# EAGLE design MQTT Wifi GW (EAGLE 7.4.0)
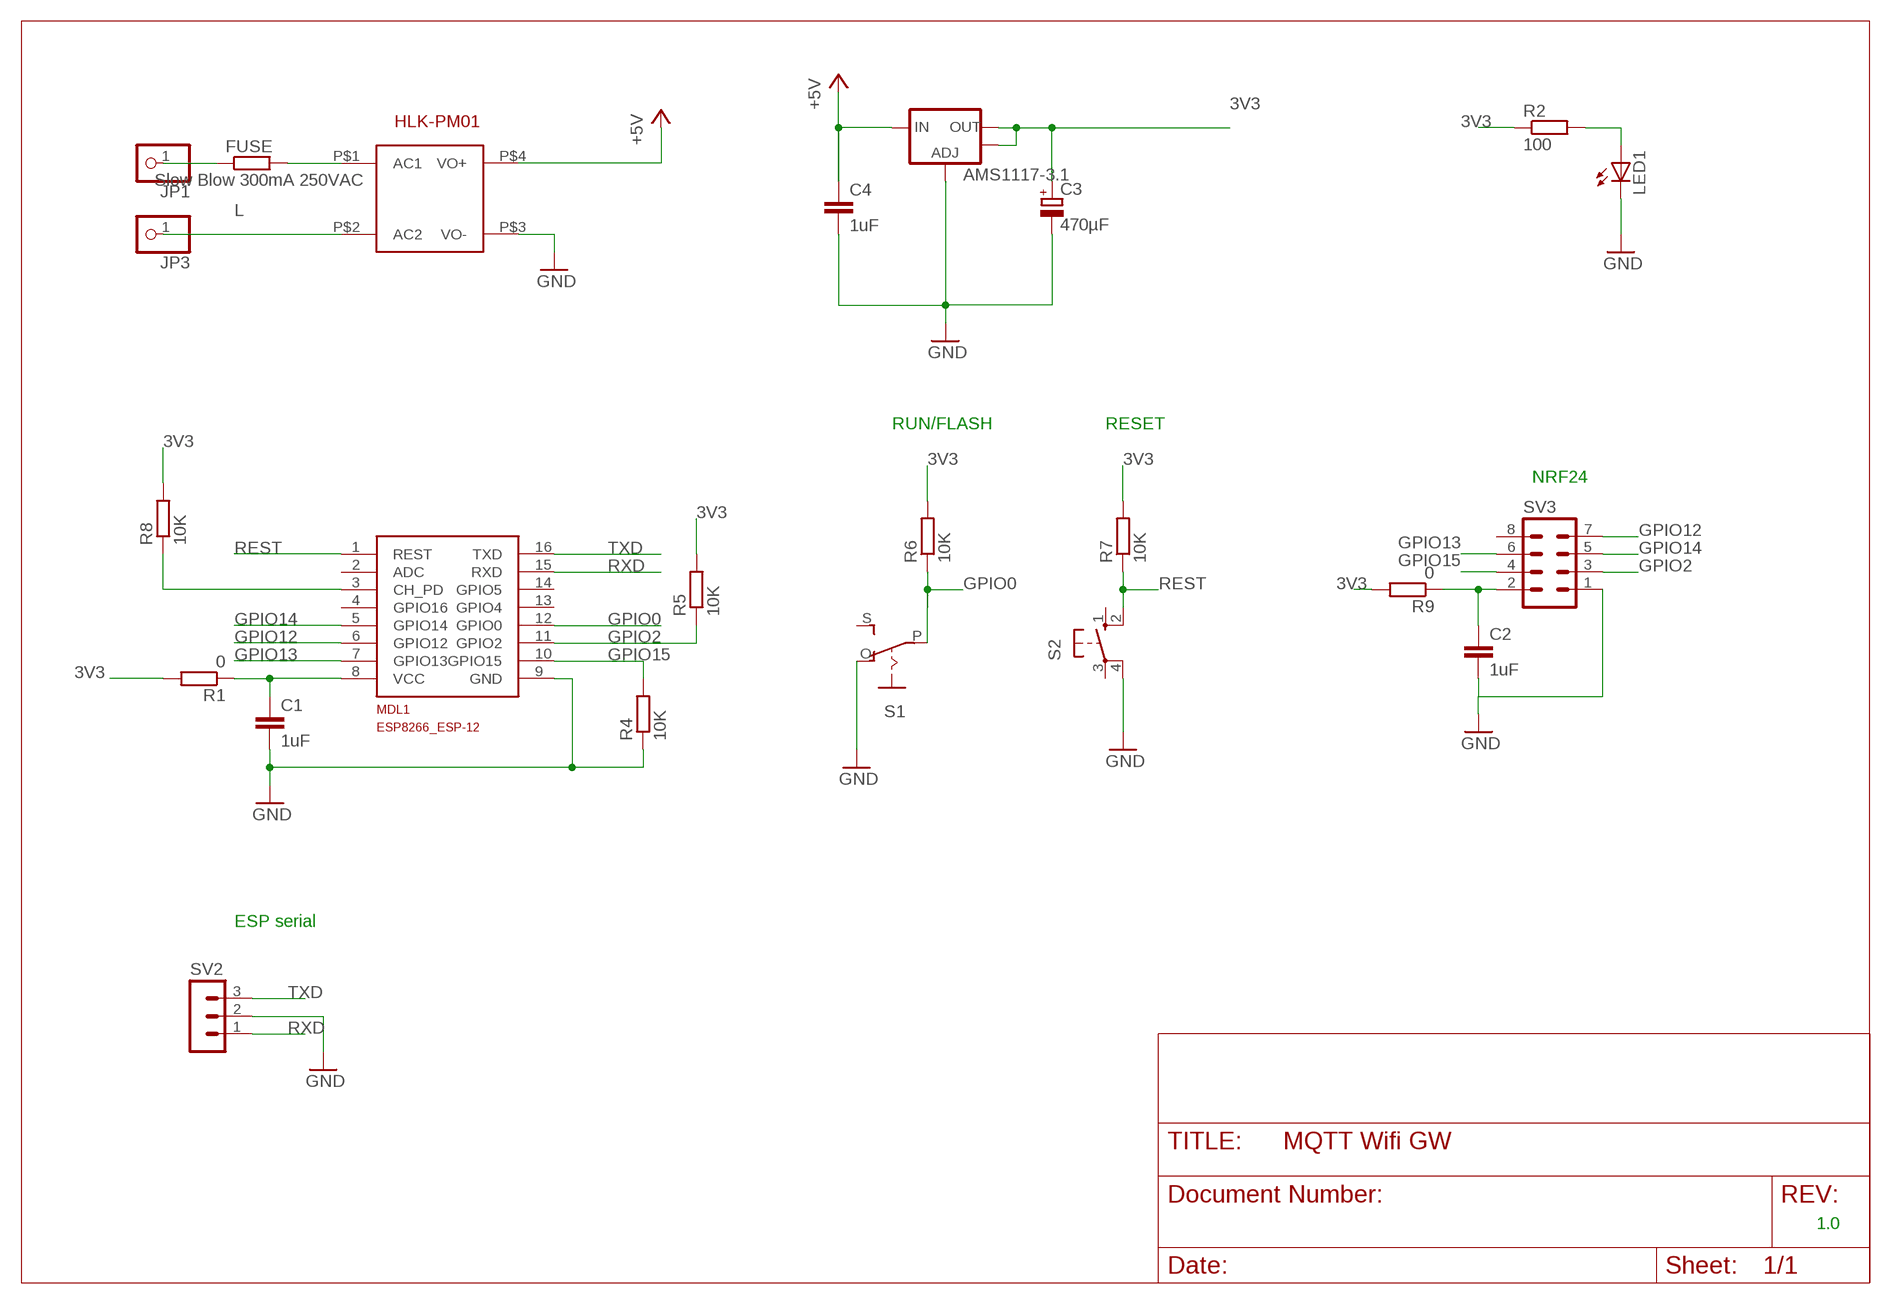
[diagram p0: schematic, sheet 1]

## Parts
AMS1117-3.1  V_REG_LM1117SOT223  [SOT223]
C1  1uF  C-EUC1206K  [C1206K]
C2  1uF  C-EUC1206K  [C1206K]
C3  470µF  CPOL-EUE5-8.5  [E5-8,5]
C4  1uF  C-EUC1206K  [C1206K]
FUSE  Slow Blow 300mA 250VAC  R-EU_0411/3V  [0411V]
HLK-PM01  HLK-PM01  [HLK-PM01]
JP1  PINHD-1X1  [1X01]
JP3  PINHD-1X1  [1X01]
LED1  LED5MM  [LED5MM]
MDL1  ESP8266-12GPIO04/05_CORRECTED  [ESP8266-ESP12]
R1  0  R-EU_R0805  [R0805]
R2  100  R-EU_0207/10  [0207/10]
R4  10K  R-EU_R0805  [R0805]
R5  10K  R-EU_R0805  [R0805]
R6  10K  R-EU_R0805  [R0805]
R7  10K  R-EU_R0805  [R0805]
R8  10K  R-EU_R1206  [R1206]
R9  0  R-EU_R1206  [R1206]
S1  EG1218S  [EG1218]
S2  10-XX  [B3F-10XX]
SV2  MA03-1  [MA03-1]
SV3  MA04-2  [MA04-2]

## Nets
3V3: AMS1117-3.1.2(OUT) AMS1117-3.1.4(OUT) C3.+ R1.2 R2.1 R5.2 R6.2 R7.2 R8.2 R9.2
+5V [dcpower]: AMS1117-3.1.3(IN) C4.1 HLK-PM01.P$4(VO+)
GND [dcpower]: AMS1117-3.1.1(ADJ) C1.2 C2.2 C3.- C4.2 HLK-PM01.P$3(VO-) LED1.K(C) MDL1.9(GND) R4.1 S1.O S2.4(P1) SV2.2 SV3.1
GPIO0: MDL1.12(GPIO0) R6.1 S1.P
GPIO2: MDL1.11(GPIO2) R5.1 SV3.3
GPIO12: MDL1.6(GPIO12) SV3.7
GPIO13: MDL1.7(GPIO13) SV3.6
GPIO14: MDL1.5(GPIO14) SV3.5
GPIO15: MDL1.10(GPIO15) R4.2 SV3.4
L: HLK-PM01.P$2(AC2) JP3.1
N$2: C2.1 R9.1 SV3.2
N$3: C1.1 MDL1.8(VCC) R1.1
N$4 [acpower]: FUSE.1 JP1.1
N$5: FUSE.2 HLK-PM01.P$1(AC1)
N$6: MDL1.3(CH_PD) R8.1
N$9: LED1.A R2.2
REST: MDL1.1(REST) R7.1 S2.2(S1)
RXD: MDL1.15(RXD) SV2.1
TXD: MDL1.16(TXD) SV2.3
Unconnected: MDL1.2(ADC) MDL1.4(GPIO16) MDL1.13(GPIO4) MDL1.14(GPIO5) S1.S S2.1(S) S2.3(P) SV3.8

## Notes on the sheet
- RUN/FLASH | RESET
- NRF24
- ESP serial
- 1.0

## Library data of the parts
AMS1117-3.1 = SparkFun-PowerIC:V_REG_LM1117: Voltage Regulator LM1117 Standard adjustable voltage regulator but in SMD form. Spark Fun Electronics SKU : COM-00595; PROD_ID: VREG-08170
C1 C2 C4 = rcl:C-EU: CAPACITOR, European symbol
C3 = rcl:CPOL-EU: POLARIZED CAPACITOR, European symbol
FUSE R2 = rcl:R-EU_: RESISTOR, European symbol
HLK-PM01 = GertSanders:HLK-PM01: HI-LINK Ultra-compact power module HLK-PM01 Meet UL, CE requirements Ultra-thin, ultra-small All voltage input (AC: 90 ~ 264V) Low ripple and low noise Output overload and short circuit protection High efficiency, high power density The product is designed to meet the requirements of EMC and Safety Test Low power consumption, environmental protection, no-load loss <0.1W 100% load aging and testing
JP1 JP3 = pinhead:PINHD-1X1: PIN HEADER
LED1 = led:LED: LED OSRAM: - CHIPLED LG R971, LG N971, LY N971, LG Q971, LY Q971, LO R971, LY R971 LH N974, LH R974 LS Q976, LO Q976, LY Q976 LO Q996 - Hyper CHIPLED LW Q18S LB Q993, LB Q99A, LB R99A - SideLED LS A670, LO A670, LY A670, LG A670, LP A670 LB A673, LV A673, LT A673, LW A673 LH A674 LY A675 LS A676, LA A676, LO A676, LY A676, LW A676 LS A679, LY A679, LG A679 - Hyper Micro SIDELED® LS Y876, LA Y876, LO Y876, LY Y876 LT Y87S - SmartLED LW L88C, LW L88S LB L89C, LB L89S, LG L890 LS L89K, LO L89K, LY L89K LS L896, LA L896, LO L896, LY L896 - TOPLED LS T670, LO T670, LY T670, LG T670, LP T670 LSG T670, LSP T670, LSY T670, LOP T670, LYG T670 LG T671, LOG T671, LSG T671 LB T673, LV T673, LT T673, LW T673 LH T674 LS T676, LA T676, LO T676, LY T676, LB T676, LH T676, LSB T676, LW T676 LB T67C, LV T67C, LT T67C, LS T67K, LO T67K, LY T67K, LW E67C LS E67B, LA E67B, LO E67B, LY E67B, LB E67C, LV E67C, LT E67C LW T67C LS T679, LY T679, LG T679 LS T770, LO T770, LY T770, LG T770, LP T770 LB T773, LV T773, LT T773, LW T773 LH T774 LS E675, LA E675, LY E675, LS T675 LS T776, LA T776, LO T776, LY T776, LB T776 LHGB T686 LT T68C, LB T68C - Hyper Mini TOPLED® LB M676 - Mini TOPLED Santana® LG M470 LS M47K, LO M47K, LY M47K Source: http://www.osram.convergy.de LUXEON: - LUMILED® LXK2-PW12-R00, LXK2-PW12-S00, LXK2-PW14-U00, LXK2-PW14-V00 LXK2-PM12-R00, LXK2-PM12-S00, LXK2-PM14-U00 LXK2-PE12-Q00, LXK2-PE12-R00, LXK2-PE12-S00, LXK2-PE14-T00, LXK2-PE14-U00 LXK2-PB12-K00, LXK2-PB12-L00, LXK2-PB12-M00, LXK2-PB14-N00, LXK2-PB14-P00, LXK2-PB14-Q00 LXK2-PR12-L00, LXK2-PR12-M00, LXK2-PR14-Q00, LXK2-PR14-R00 LXK2-PD12-Q00, LXK2-PD12-R00, LXK2-PD12-S00 LXK2-PH12-R00, LXK2-PH12-S00 LXK2-PL12-P00, LXK2-PL12-Q00, LXK2-PL12-R00 Source: www.luxeon.com KINGBRIGHT: KA-3528ASYC Source: www.kingbright.com
MDL1 = ESP8266-ESP12:ESP8266-12: Espressif ESP8266 ESP-12 Module with GPIO04 and GPIO05 corrected.
R1 R4-R9 = resistor:R-EU_: RESISTOR, European symbol; SPICEPREFIX: R
S1 = adafruit:EG1218: SLIDING SWITCH 0.1" spacing through hole, vertical SPDT slide switch http://www.ladyada.net/library/pcb/eaglelibrary.html
S2 = switch-omron:10-XX: OMRON SWITCH; MPN: B3F-1000; OC_FARNELL: 176432; OC_NEWARK: 36M3542
SV2 = con-lstb:MA03-1: PIN HEADER; OC_FARNELL: unknown; OC_NEWARK: unknown
SV3 = con-lstb:MA04-2: PIN HEADER; OC_FARNELL: unknown; OC_NEWARK: unknown

## Net classes
1 dcpower: width 0.635 mm
2 acpower: width 2.54 mm, clearance 1.524 mm

## Board
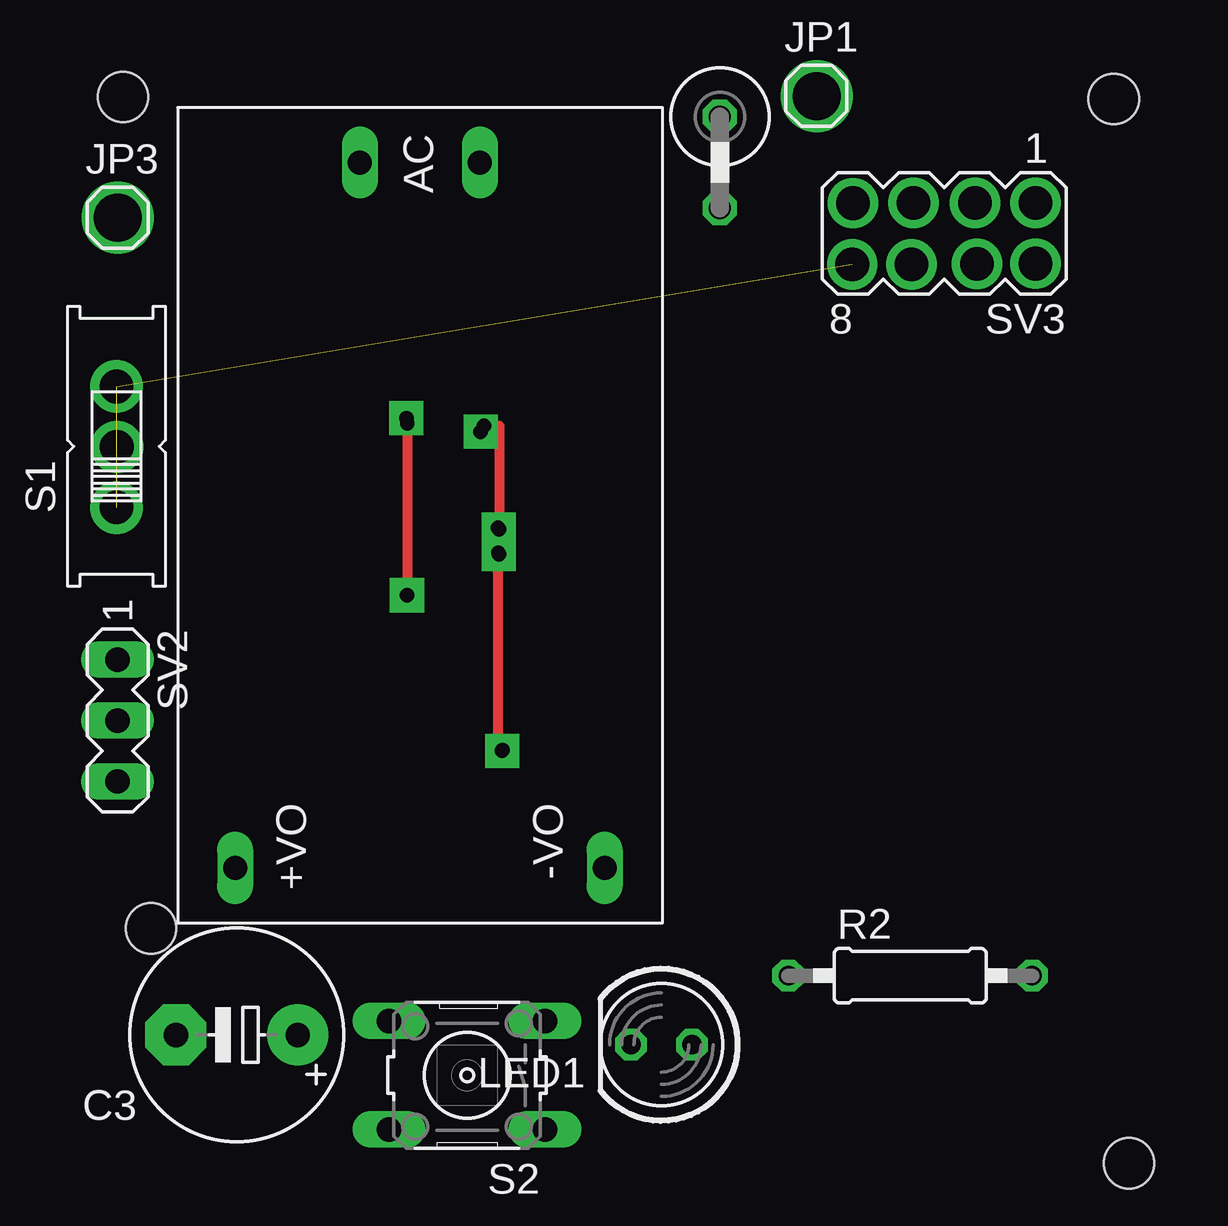
[diagram p1: board, top side]
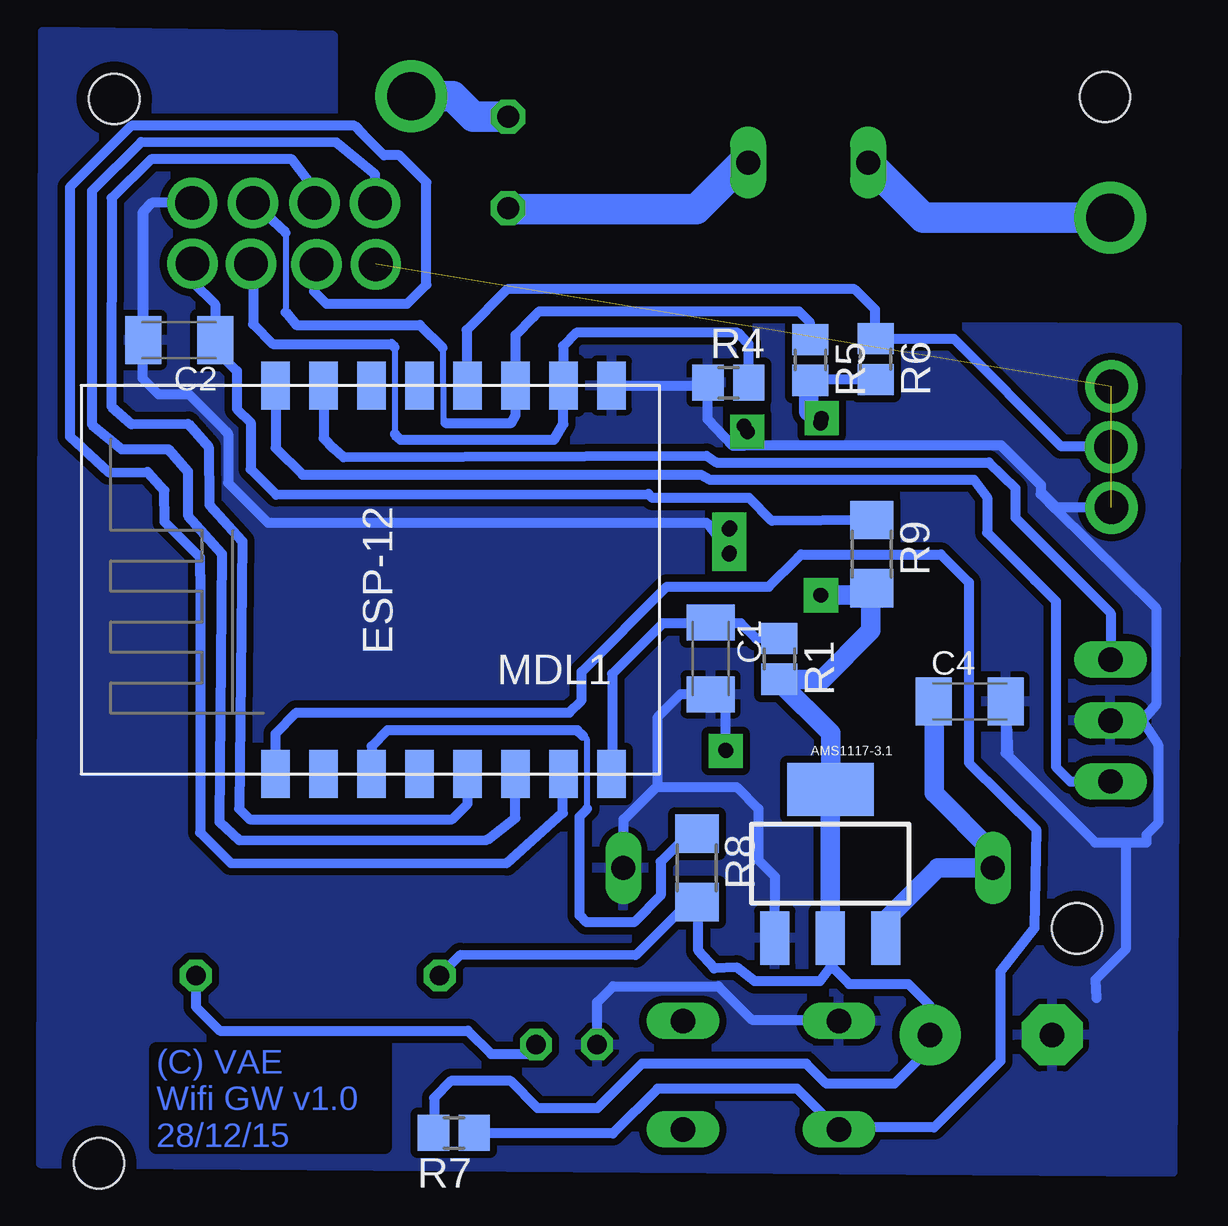
[diagram p2: board, bottom side, seen from below]

No outline drawn. Coordinates in mm, seen from the top.
Copper layers (1*16): Top 0.035mm / dielectric 1.5mm / Bottom 0.035mm
Design rules "ShenZhen2U EagleRules": minimum track width 7mil, minimum drill 12mil, track to track 7mil, track to pad 7mil, pad to pad 7mil, via to via 7mil, smd to smd 0mil, copper to edge 20mil, drill to drill 10mil, minimum pad ring 10mil, minimum via ring 6mil, stop-mask expansion 2mil, vias tented up to drill 25mil, thermal gap 10mil
Holes 2.1 mm at 5.95,46.31 47.22,46.23 7.11,11.66 47.85,1.86

### Footprints (pad centres in the part's own frame; a part is rotated, then mirrored left to right if it is on the bottom)
SOT223 = smd 1.219 x 2.235: 1 -2.311,-3.099; 2 0,-3.099; 3 2.311,-3.099 | smd 3.6 x 2.2: 4 0,3.099
C1206K = smd 1.5 x 2: 1 -1.5,0; 2 1.5,0
E5-8,5 = drill 1.016 pad 2.54: + -2.54,0 | drill 1.016 pad 2.54 octagon: - 2.54,0
0411V = drill 0.914 octagon: 1 -2.54,0; 2 1.27,0
HLK-PM01 = drill 1 long: P$1 -14.7,2.5; P$2 -14.7,-2.5; P$3 14.7,7.7; P$4 14.7,-7.7
1X01 = drill 1.016 octagon: 1 0,0
LED5MM = drill 0.813 octagon: A -1.27,0; K 1.27,0
ESP8266-ESP12 = smd 2 x 1.2: 1 0,16; 2 0,14; 3 0,12; 4 0,10; 5 0,8; 6 0,6; 7 0,4; 8 0,2; 9 16.2,2; 10 16.2,4; 11 16.2,6; 12 16.2,8; 13 16.2,10; 14 16.2,12; 15 16.2,14; 16 16.2,16
R0805 = smd 1.3 x 1.5: 1 -0.85,0; 2 0.85,0
0207/10 = drill 0.813 octagon: 1 -5.08,0; 2 5.08,0
R1206 = smd 1.6 x 1.803: 1 -1.422,0; 2 1.422,0
EG1218 = drill 0.9 pad 1.676: O -2.54,0; P 0,0; S 2.54,0
B3F-10XX = drill 1.016 long: 1 -3.251,2.261; 2 3.251,2.261; 3 -3.251,-2.261; 4 3.251,-2.261
MA03-1 = drill 1.016 long: 1 -2.54,0; 2 0,0; 3 2.54,0
MA04-2 = drill 1.016 octagon: 1 -3.81,-1.27; 2 -3.81,1.27; 3 -1.27,-1.27; 4 -1.27,1.27; 5 1.27,-1.27; 6 1.27,1.27; 7 3.81,-1.27; 8 3.81,1.27

### Placement (x,y rotation side)
AMS1117-3.1  17.39,14.35 0 bottom
C1  22.38,22.91 270 bottom
C2  44.52,36.18 180 bottom
C3  10.69,7.22 180 top
C4  11.58,21.11 0 bottom
FUSE  30.81,42.94 270 top
HLK-PM01  18.31,28.88 270 top
JP1  34.84,46.36 0 top
JP3  5.71,41.27 0 top
LED1  28.37,6.81 180 top
MDL1  24.5,18.08 90 bottom
R1  19.51,22.89 270 bottom
R2  38.74,9.69 0 top
R4  21.63,34.4 0 bottom
R5  18.22,35.35 270 bottom
R6  15.5,35.38 270 bottom
R7  33.07,3.13 180 bottom
R8  22.94,14.18 270 bottom
R9  15.66,27.25 270 bottom
S1  5.67,31.75 90 top
S2  20.28,5.54 180 top
SV2  5.71,20.32 270 top
SV3  40.16,40.63 180 top

### Tracks (layer width: path | path; a pad name or v marks a point on that pad's centre or on a via)
3V3  (via drill 0.6)
  Top 0.406: v17.79,32.71 v17.79,25.55
  Bottom 0.406: R2.1 32.8,10.55 25.49,10.54 23.28,12.75 R8.2 22.89,12.7 22.89,10.72 22.23,9.99 21.28,10.03 20.54,9.45 17.82,9.45 17.39,10.03 AMS1117-3.1.2 17.39,10.03 17.29,10.03 16.61,9.34 14.13,9.34 13.24,8.46 13.24,7.23 C3.+ 13.22,6.67 14.72,5.18 17.55,5.18 18.39,6.02 25.24,6.02 27.09,4.16 29.58,4.16 30.71,5.29 33.2,5.29 33.9,4.59 33.9,3.15 R7.2 | R1.2 19.51,21.93 | 17.38,17.46 AMS1117-3.1.4 | R5.2 18.19,34.53 R6.2 18.27,34.53 18.28,34.55 | 15.94,25.55 R9.2
  Bottom 0.813: AMS1117-3.1.4 AMS1117-3.1.2 | 19.51,21.93 17.38,19.8 17.38,17.46 | R1.2 17.73,22.04 15.7,24.07 15.7,25.8 R9.2 | 15.94,25.55 v17.79,25.55 | 18.28,34.55 18.28,33.2 v17.79,32.71
+5V
  Bottom 0.813: AMS1117-3.1.3 15.07,12.02 12.91,14.18 HLK-PM01.P$4 10.61,14.85 13.07,17.3 13.07,21.1 C4.1
GND  (via drill 0.6)  (1 unrouted)
  Top 0.406: v20.98,32.6 21.62,32.6 21.62,27.65 | v21.75,19.09 21.57,19.09 21.57,27.65 21.74,27.65 v21.58,27.32
  Bottom 0.406: SV2.2 4.39,20.32 | 4.39,20.32 3.72,19.31 3.72,16.05 4.21,15.57 4.21,15.24 5.08,15.24 | 6.3,8.75 6.34,9.52 5.08,10.78 5.08,15.24 | 21.45,31.78 22.5,32.88 R4.1 22.61,34.28 MDL1.9 | 21.45,31.78 21.12,31.79 14.2,31.8 10.31,31.8 | 10.31,31.8 10.26,31.8 8.61,30.15 8.61,29.86 7.97,29.21 S1.O | 10.31,31.8 8.62,30.12 8.62,29.75 8.01,29.14 7.99,29.14 3.81,25 3.81,20.99 4.39,20.32 | 26,16.18 26,16.2 24.6,17.6 24.6,20.44 23.63,21.41 C1.2 21.75,21.41 v21.75,19.09 | AMS1117-3.1.1 19.7,12.62 19.7,13.82 20.38,14.51 20.38,16.64 21.3,17.55 24.62,17.55 26,16.18 | 25.99,14.2 26,14.2 | 26,14.2 HLK-PM01.P$3 | 26,14.2 26,16.18 | C2.2 46.01,41.53 45.65,41.9 SV3.1 45.63,41.9 46.05,41.48 46.05,34.59 45.38,33.92 44.11,33.92 42.61,32.42 42.61,32.4 42.47,32.27 42.47,30.22 40.82,28.57 22.54,28.57 v21.58,27.32 | v21.58,27.32 21.62,27.65 | 21.62,27.65 21.57,27.6 | 21.57,27.6 21.38,27.41 21.38,27.77 v21.58,27.32 | 9.96,18.85 C4.2 10.08,18.97 6.35,15.24 5.08,15.24 | 21.45,31.78 20.98,31.78 v20.98,32.6 | 21.62,27.65 21.57,27.65 21.57,27.6 | LED1.K 27.11,8.58 26.43,9.25 22.05,9.25 20.66,7.85 17.08,7.85 S2.4
  pour Bottom (isolate 0.305): 2.93,36.68 38.1,36.83 38.1,48.86 50.21,49.03 50.29,1.87 3.12,1.51
GPIO0
  Bottom 0.406: MDL1.12 32.54,34.32 32.54,36.6 30.84,38.3 16.37,38.3 15.53,37.46 15.53,36.27 R6.1 12.24,36.23 7.76,31.75 S1.P
GPIO2
  Bottom 0.254: 33.54,35.86 33.51,32.8 33.42,32.72 | 40.08,40.65 40.08,37.34
  Bottom 0.406: SV3.3 40.08,40.65 | 40.08,37.34 39.64,36.81 34.49,36.81 33.54,35.86 | 33.42,32.72 30.68,32.72 30.5,33.04 MDL1.11 30.5,36.39 29.74,37.15 29.74,37.16 29.51,37.38 18.7,37.38 18.25,36.94 18.25,36.23 R5.1
GPIO12
  Bottom 0.406: SV3.7 36.35,43.08 37.97,44.41 46.1,44.43 48.16,42.39 48.16,32.66 46.91,31.63 44.97,31.63 44.15,30.7 44.16,28.87 42.73,27.28 42.84,16.09 42.02,15.33 31.69,15.35 30.51,16.26 MDL1.6
GPIO13
  Bottom 0.406: SV3.6 38.89,38.2 38.38,37.69 35.01,37.69 34.21,38.49 34.21,42.75 35.34,43.88 35.98,43.88 36.86,44.75 36.86,44.77 37.2,45.11 46.51,45.11 49.08,42.54 49.08,32.15 47.45,30.67 45.83,30.68 45.14,29.91 45.12,28.6 43.64,27.12 43.64,26.4 43.64,15.65 42.37,14.38 30.87,14.37 28.52,16.47 28.52,18.06 MDL1.7
GPIO14
  Bottom 0.406: SV3.5 38.89,42.48 39.83,43.71 45.69,43.71 47.33,42.1 47.34,33.41 46.51,32.67 44.15,32.7 43.29,31.72 43.26,29.31 41.88,27.79 42.02,16.64 41.58,16.2 33.15,16.2 32.5,16.85 MDL1.5
GPIO15
  Bottom 0.254: 35.54,35.88 35.54,32.28 35.52,32.26
  Bottom 0.406: R4.2 20.79,36.02 20.96,36.2 20.98,36.2 21.25,36.48 27.97,36.48 28.52,35.93 28.52,34.3 MDL1.10 28.51,32.67 28.89,32.03 35.29,32.03 35.52,32.24 35.52,32.26 | SV3.4 41.43,36.84 40.61,36.02 35.68,36.02 35.54,35.88
L
  Bottom 1.27: JP3.1 13.51,41.27 HLK-PM01.P$2
N$2
  Bottom 0.406: SV3.2 43.97,38.62 43.02,37.67 C2.1 43.04,36.16 43.38,36.16 42.11,34.89 42.11,33.31 41.54,32.74 41.54,30.8 40.48,29.73 24.97,29.77 24.79,29.6 20.77,29.6 19.82,28.64 R9.1
N$3
  Bottom 0.406: R1.1 20.47,23.74 21.11,24.37 22.34,24.37 | 22.34,24.37 C1.1 | 22.34,24.37 24.37,24.37 26.48,22.26 26.48,18.11 MDL1.8
N$4
  Bottom 1.27: FUSE.1 32.26,45.48 33.11,46.34 34.82,46.34 JP1.1
N$5
  Bottom 1.27: HLK-PM01.P$1 21.04,43.58 22.97,41.65 30.78,41.65 FUSE.2
N$6
  Bottom 0.254: 27.52,16.64 27.52,19.52 27.68,19.69
  Bottom 0.406: R8.1 23.29,15.6 24.45,14.43 24.45,13.02 25.56,11.91 27.55,11.91 27.83,12.2 27.83,16.32 27.52,16.64 | 27.68,19.69 27.7,19.69 27.92,19.91 35.84,19.91 36.5,19.25 MDL1.3
N$7  (via drill 0.6)
  other vias: 21.56,28.35
N$8
  Bottom 0.406: 5.75,20.33 5.73,20.33 5.71,20.31 4.52,20.31
N$9
  Bottom 0.406: R2.2 43.82,8.39 42.82,7.39 32.49,7.39 31.52,6.42 29.61,6.42 LED1.A
N$10  (via drill 1.4)
  other vias: 36.35,41.89
N$12  (via drill 1.4, 1.4 pad 0.25, 1.4 pad 0.3)  (3 unrouted)
  other vias: 36.33,39.33 5.67,34.24 5.68,31.74 5.67,29.2
N$13  (via drill 1.4)
  other vias: 38.79,39.33
N$14  (via drill 1.4)
  other vias: 41.53,39.35
N$15  (via drill 1.4)
  other vias: 38.89,41.89
N$16  (via drill 1.4)
  other vias: 41.44,41.9
N$17  (via drill 1.4)
  other vias: 43.97,41.89
N$18  (via drill 1.4)
  other vias: 43.97,39.36
N$19  (via drill 2 pad 0.3)
  other vias: 34.84,46.35
N$20  (via drill 2 pad 0.3)
  other vias: 5.71,41.28
N$21  (via drill 0.5 pad 2.18)
  other vias: 5.67,34.24
N$22  (via drill 0.5 pad 2.18)
  other vias: 5.69,31.72
N$23  (via drill 0.5 pad 2.18)
  other vias: 5.67,29.19
N$24  (via drill 0.5 pad 2.18)
  other vias: 5.71,41.26
N$25  (via drill 0.5 pad 2.18)
  other vias: 34.85,46.36
N$26  (via drill 0.5 pad 1.78)
  other vias: 36.36,41.91
N$27  (via drill 0.5 pad 1.78)
  other vias: 38.89,41.91
N$28  (via drill 0.5 pad 1.78)
  other vias: 41.44,41.89
N$29  (via drill 0.5 pad 1.78)
  other vias: 43.96,41.89
N$30  (via drill 0.5 pad 1.78)
  other vias: 43.99,39.39
N$31  (via drill 0.5 pad 1.78)
  other vias: 41.52,39.36
N$32  (via drill 0.5 pad 1.78)
  other vias: 38.75,39.36
N$33  (via drill 0.5 pad 1.78)
  other vias: 36.31,39.36
N$34  (via drill 0.6 pad 1.42)
  other vias: 17.75,32.93
N$35  (via drill 0.6 pad 1.42)
  other vias: 20.84,32.36
N$36  (via drill 0.6 pad 1.42)
  other vias: 21.6,28.29
N$37  (via drill 0.6 pad 1.42)
  other vias: 21.6,27.26
N$38  (via drill 0.6 pad 1.42)
  other vias: 21.74,19.06
N$39  (via drill 0.6 pad 1.42)
  other vias: 17.78,25.54
REST
  Bottom 0.406: MDL1.1 40.5,19.78 39.63,20.65 28.26,20.65 27.75,21.17 27.75,22.35 24.2,25.91 19.95,25.91 18.73,27.12 18.72,27.12 18.61,27.24 12.78,27.24 11.62,26.08 11.62,18.56 8.81,15.78 8.88,11.68 10.3,9.88 10.3,6.12 13.06,3.36 16.95,3.36 S2.2 17.07,3.27 18.77,4.98 24.58,4.98 26.45,3.11 32.2,3.11 R7.1
RXD
  Bottom 0.406: MDL1.15 38.5,32.09 38.07,31.66 38.07,31.65 37.67,31.3 22.55,31.36 22.13,31.08 10.78,31.08 9.68,30.01 9.68,28.77 5.7,24.8 SV2.1
TXD
  Bottom 0.406: MDL1.16 40.5,31.68 39.37,30.57 22.78,30.57 22.41,30.36 11.41,30.36 10.85,29.62 10.85,28.15 8.87,26.17 7.99,25.3 7.99,18.39 7.38,17.78 SV2.3

### Text on the board
Bottom: (C) VAE / Wifi GW v1.0 / 28/12/15